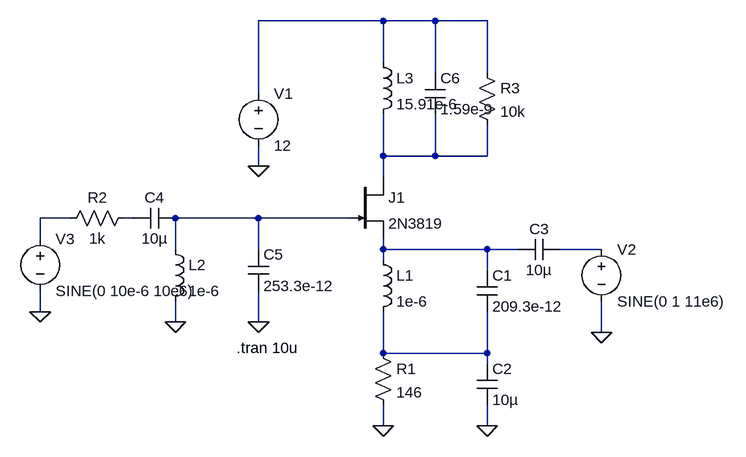
[diagram p0: schematic mezclador_jfet.asc]
mezclador_jfet.asc, the LTspice schematic file:
Version 4
SHEET 1 880 680
WIRE 176 -144 -16 -144
WIRE 256 -144 176 -144
WIRE 336 -144 256 -144
WIRE 176 -80 176 -144
WIRE 256 -64 256 -144
WIRE 336 -64 336 -144
WIRE -16 -32 -16 -144
WIRE 176 64 176 0
WIRE 256 64 256 0
WIRE 256 64 176 64
WIRE 336 64 336 16
WIRE 336 64 256 64
WIRE -16 80 -16 48
WIRE 176 96 176 64
WIRE -304 160 -352 160
WIRE -208 160 -224 160
WIRE -16 160 -144 160
WIRE 128 160 -16 160
WIRE -352 192 -352 160
WIRE -144 208 -144 160
WIRE -16 208 -16 160
WIRE 176 208 176 192
WIRE 336 208 176 208
WIRE 384 208 336 208
WIRE 512 208 448 208
WIRE 176 224 176 208
WIRE 336 240 336 208
WIRE -352 304 -352 272
WIRE -144 320 -144 288
WIRE -16 320 -16 272
WIRE 512 336 512 288
WIRE 176 368 176 304
WIRE 336 368 336 304
WIRE 336 368 176 368
WIRE 336 384 336 368
WIRE 176 480 176 448
WIRE 336 480 336 448
FLAG 176 480 0
FLAG -16 80 0
FLAG 336 480 0
FLAG 512 336 0
FLAG -352 304 0
FLAG -144 320 0
FLAG -16 320 0
SYMBOL njf 128 96 R0
SYMATTR InstName J1
SYMATTR Value 2N3819
SYMBOL res 160 352 R0
SYMATTR InstName R1
SYMATTR Value 146
SYMBOL voltage -16 -48 R0
WINDOW 123 0 0 Left 0
WINDOW 39 0 0 Left 0
SYMATTR InstName V1
SYMATTR Value 12
SYMBOL ind 160 208 R0
SYMATTR InstName L1
SYMATTR Value 1e-6
SYMBOL cap 320 240 R0
SYMATTR InstName C1
SYMATTR Value 209.3e-12
SYMBOL cap 320 384 R0
SYMATTR InstName C2
SYMATTR Value 10µ
SYMBOL cap 448 192 R90
WINDOW 0 0 32 VBottom 2
WINDOW 3 32 32 VTop 2
SYMATTR InstName C3
SYMATTR Value 10µ
SYMBOL voltage 512 192 R0
WINDOW 123 0 0 Left 0
WINDOW 39 0 0 Left 0
SYMATTR InstName V2
SYMATTR Value SINE(0 1 11e6)
SYMBOL voltage -352 176 R0
WINDOW 123 0 0 Left 0
WINDOW 39 0 0 Left 0
SYMATTR InstName V3
SYMATTR Value SINE(0 10e-6 10e6)
SYMBOL res -208 144 R90
WINDOW 0 0 56 VBottom 2
WINDOW 3 32 56 VTop 2
SYMATTR InstName R2
SYMATTR Value 1k
SYMBOL cap -144 144 R90
WINDOW 0 0 32 VBottom 2
WINDOW 3 32 32 VTop 2
SYMATTR InstName C4
SYMATTR Value 10µ
SYMBOL cap -32 208 R0
SYMATTR InstName C5
SYMATTR Value 253.3e-12
SYMBOL ind -160 192 R0
SYMATTR InstName L2
SYMATTR Value 1e-6
SYMBOL ind 160 -96 R0
SYMATTR InstName L3
SYMATTR Value 15.91e-6
SYMBOL cap 240 -64 R0
SYMATTR InstName C6
SYMATTR Value 1.59e-9
SYMBOL res 320 -80 R0
SYMATTR InstName R3
SYMATTR Value 10k
TEXT -50 360 Left 2 !.tran 10u

The netlist it stands for:
* mezclador_jfet.asc
J1 N002 N005 N006 2N3819
R1 N008 0 146
V1 N001 0 12
L1 N006 N008 1e-6
C1 N006 N008 209.3e-12
C2 N008 0 10µ
C3 N007 N006 10µ
V2 N007 0 SINE(0 1 11e6)
V3 N003 0 SINE(0 10e-6 10e6)
R2 N004 N003 1k
C4 N005 N004 10µ
C5 N005 0 253.3e-12
L2 N005 0 1e-6
L3 N001 N002 15.91e-6
C6 N001 N002 1.59e-9
R3 N001 N002 10k
.model NJF NJF
.model PJF PJF
.lib standard.jft
.tran 10u
.backanno
.end